# EAGLE schematic schaltplan (EAGLE 7.7.0)
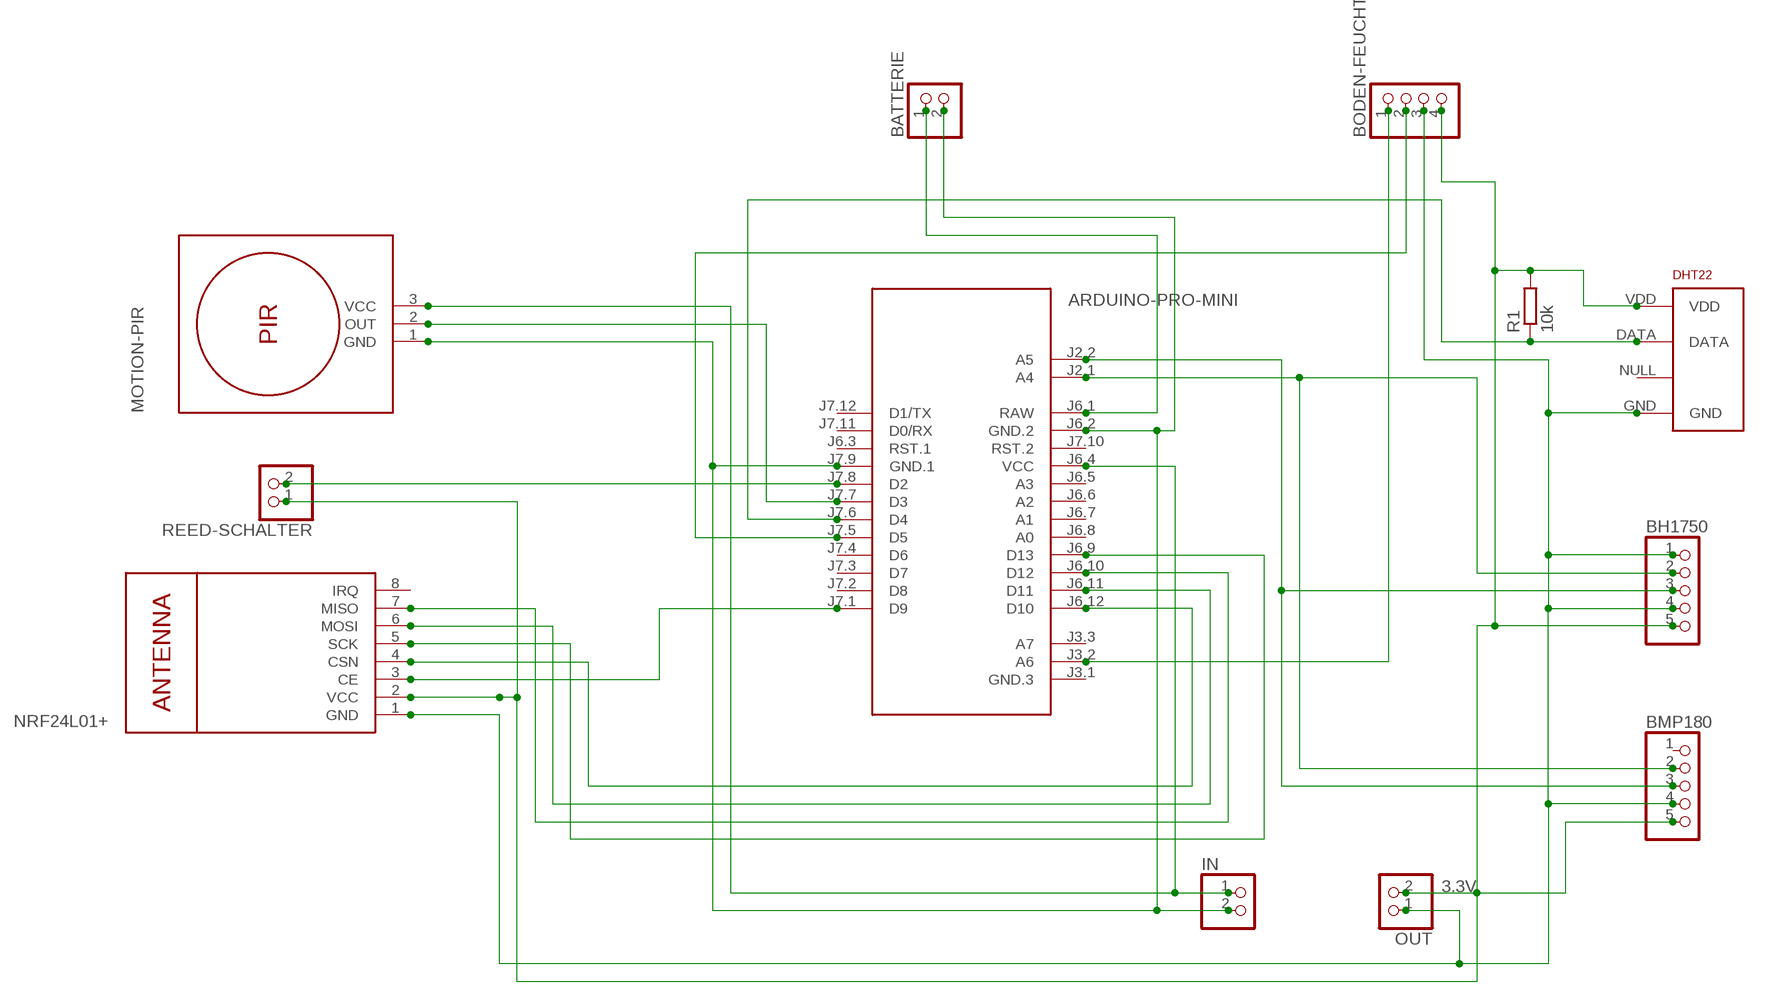
[diagram p0: schematic, sheet 1]

## Parts
ARDUINO-PRO-MINI  ARDUINO-PRO-MINI-5.0V#NP  [ARDUINO-PRO-MINI#NP]
BATTERIE  PINHD-1X2  [1X02]
BH1750  PINHD-1X5  [1X05]
BMP180  PINHD-1X5  [1X05]
BODEN-FEUCHT  PINHD-1X4  [1X04]
DHT22  RHT03_DHT-22_AM2302  [RHT03_DHT-22]
IN  PINHD-1X2  [1X02]
MOTION-PIR  MOTION-PIR-DYP-ME003  [MOTION-PIR-DYP-ME003]
NRF24L01+  WIRELESS-NRF24L01  [WIRELESS-NRF24L01]
OUT  PINHD-1X2  [1X02]
R1  10k  R-EU_0207/10  [0207/10]
REED-SCHALTER  PINHD-1X2  [1X02]

## Nets
3.3V: BH1750.5 BMP180.5 BODEN-FEUCHT.4 DHT22.VDD NRF24L01+.2(VCC) OUT.2 R1.2 REED-SCHALTER.1
GND: ARDUINO-PRO-MINI.J6.2(GND.2) ARDUINO-PRO-MINI.J7.9(GND.1) BATTERIE.2 BH1750.1 BH1750.4 BMP180.4 BODEN-FEUCHT.3 DHT22.GND IN.2 MOTION-PIR.1(GND) NRF24L01+.1(GND) OUT.1
N$2: ARDUINO-PRO-MINI.J6.4(VCC) IN.1 MOTION-PIR.3(VCC)
N$3: ARDUINO-PRO-MINI.J7.6(D4) DHT22.DATA R1.1
N$4: ARDUINO-PRO-MINI.J7.7(D3) MOTION-PIR.2(OUT)
N$5: ARDUINO-PRO-MINI.J2.2(A5) BH1750.3 BMP180.3
N$6: ARDUINO-PRO-MINI.J7.1(D9) NRF24L01+.3(CE)
N$7: ARDUINO-PRO-MINI.J6.12(D10) NRF24L01+.4(CSN)
N$8: ARDUINO-PRO-MINI.J6.9(D13) NRF24L01+.5(SCK)
N$9: ARDUINO-PRO-MINI.J6.11(D11) NRF24L01+.6(MOSI)
N$10: ARDUINO-PRO-MINI.J6.10(D12) NRF24L01+.7(MISO)
N$11: ARDUINO-PRO-MINI.J7.8(D2) REED-SCHALTER.2
N$12: ARDUINO-PRO-MINI.J2.1(A4) BH1750.2 BMP180.2
N$14: ARDUINO-PRO-MINI.J3.2(A6) BODEN-FEUCHT.1
N$15: ARDUINO-PRO-MINI.J7.5(D5) BODEN-FEUCHT.2
RAW: ARDUINO-PRO-MINI.J6.1(RAW) BATTERIE.1
Unconnected: ARDUINO-PRO-MINI.J3.1(GND.3) ARDUINO-PRO-MINI.J3.3(A7) ARDUINO-PRO-MINI.J6.3(RST.1) ARDUINO-PRO-MINI.J6.5(A3) ARDUINO-PRO-MINI.J6.6(A2) ARDUINO-PRO-MINI.J6.7(A1) ARDUINO-PRO-MINI.J6.8(A0) ARDUINO-PRO-MINI.J7.2(D8) ARDUINO-PRO-MINI.J7.3(D7) ARDUINO-PRO-MINI.J7.4(D6) ARDUINO-PRO-MINI.J7.10(RST.2) ARDUINO-PRO-MINI.J7.11(D0/RX) ARDUINO-PRO-MINI.J7.12(D1/TX) BMP180.1 DHT22.NULL NRF24L01+.8(IRQ)

## Library data of the parts
ARDUINO-PRO-MINI = diy-modules:ARDUINO-PRO-MINI-*#NP: Arduino Pro Mini without programming pads
BATTERIE IN OUT REED-SCHALTER = pinhead:PINHD-1X2: PIN HEADER
BH1750 BMP180 = pinhead:PINHD-1X5: PIN HEADER
BODEN-FEUCHT = pinhead:PINHD-1X4: PIN HEADER
DHT22 = RHT03_DHT-22_AM2302:RHT03_DHT-22_AM2302: RHT03 / DHT-22 / AM2302 Packages and symbol for the RHT03 / DHT-22 relative humidity and temperature sensor. Note: The AM2302 is a wired version of the DHT-22 which typically requires less clearance and is thus provided as a separate package.; PROD_ID: SEN-10167
MOTION-PIR = diy-modules:MOTION-PIR-DYP-ME003: PIR Motion Sensor Module DYP-ME003 based on BISS0001 pyroelectic detector
NRF24L01+ = diy-modules:WIRELESS-NRF24L01: 2.4 GHz Wireless Module based on NRF24L01 chip
R1 = resistor:R-EU_: RESISTOR, European symbol